# EAGLE design ver3.0+VinSeparat (EAGLE 6.1)
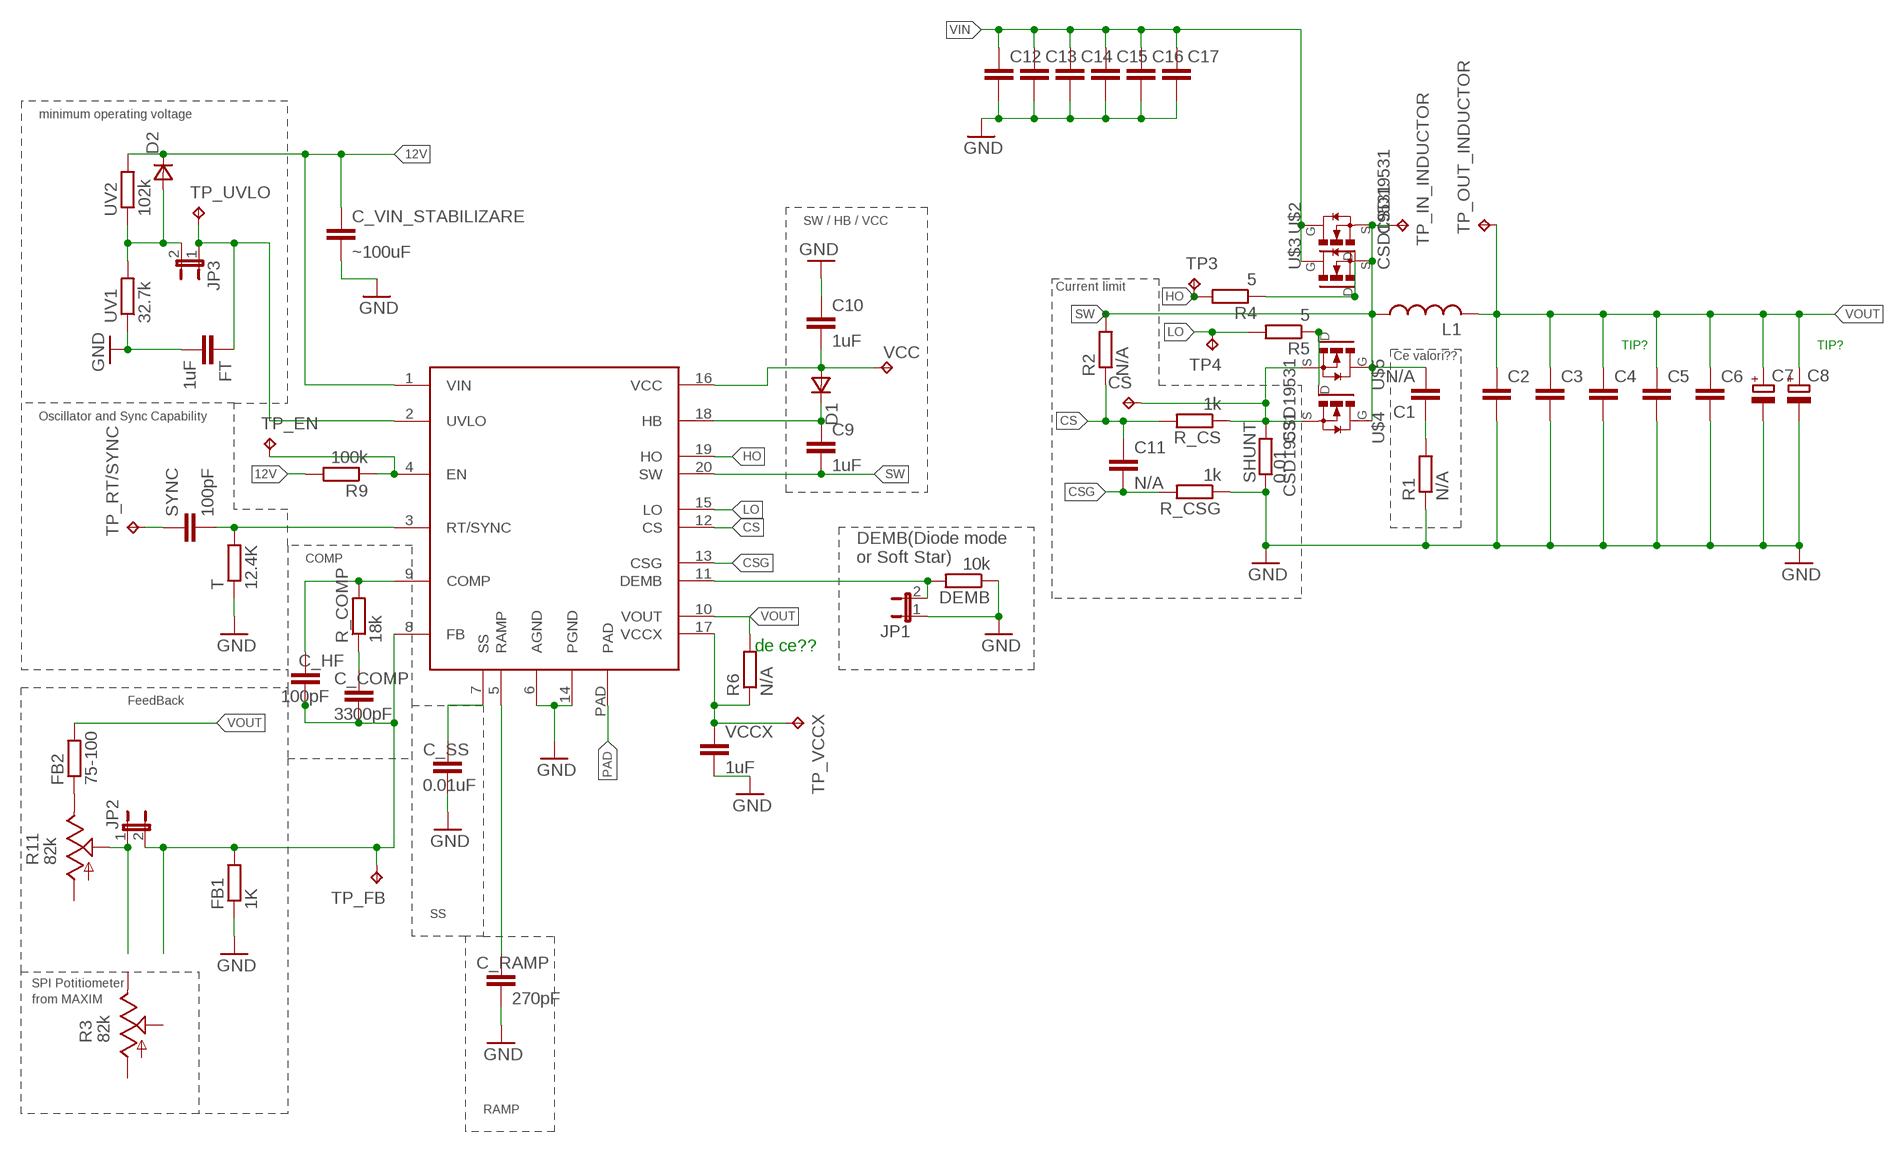
[diagram p0: schematic, sheet 1]

## Parts
C1  N/A  C-EUC0805K  [C0805K]
C2  C-EUC1812  [C1812]
C3  C-EUC1812  [C1812]
C4  C-EUC1812  [C1812]
C5  C-EUC1812  [C1812]
C6  C-EUC1812  [C1812]
C7  CPOL-EU153CLV-1012  [153CLV-1012]
C8  CPOL-EU153CLV-1012  [153CLV-1012]
C9  1uF  C-EUC0805K  [C0805K]
C10  1uF  C-EUC0805K  [C0805K]
C11  N/A  C-EUC0805K  [C0805K]
C12  C-EUC1812K  [C1812K]
C13  C-EUC1812K  [C1812K]
C14  C-EUC1812K  [C1812K]
C15  C-EUC1812K  [C1812K]
C16  C-EUC1812K  [C1812K]
C17  C-EUC1812K  [C1812K]
C_COMP  3300pF  C-EUC0805K  [C0805K]
C_HF  100pF  C-EUC0805K  [C0805K]
C_RAMP  270pF  C-EUC0805K  [C0805K]
C_SS  0.01uF  C-EUC0805K  [C0805K]
C_VIN_STABILIZARE  ~100uF  C-EUC0805K  [C0805K]
CS  TPPAD1-20  [P1-20]
D1  DSOT23  [SOT-23]
D2  DSOT23  [SOT-23]
DEMB  10k  R-EU_R0603  [R0603]
FB1  1K  R-EU_R0603  [R0603]
FB2  75-100  R-EU_R0603  [R0603]
FT  1uF  C-EUC1812K  [C1812K]
JP1  JP1E  [JP1]
JP2  JP1E  [JP1]
JP3  JP1E  [JP1]
L1  L-USTJ8-U2  [TJ8-U2]
R1  N/A  R-EU_M1206  [M1206]
R2  N/A  R-EU_R0603  [R0603]
R3  82k  TRIM_US-B64Y  [B64Y]
R4  5  R-EU_M1206  [M1206]
R5  5  R-EU_M1206  [M1206]
R6  N/A  R-EU_R0603  [R0603]
R9  100k  R-EU_R0603  [R0603]
R11  82k  TRIM_US-B64Y  [B64Y]
R_COMP  18k  R-EU_R0603  [R0603]
R_CS  1k  R-EU_R0603  [R0603]
R_CSG  1k  R-EU_R0603  [R0603]
SHUNT  0.01  SMR-0  [SMR-0]
SYNC  100pF  C-EUC0805K  [C0805K]
T  12.4K  R-EU_R0603  [R0603]
TP3  TPPAD1-20  [P1-20]
TP4  TPPAD1-20  [P1-20]
TP_EN  TPPAD1-20  [P1-20]
TP_FB  TPPAD1-20  [P1-20]
TP_IN_INDUCTOR  TPPAD1-20  [P1-20]
TP_OUT_INDUCTOR  TPPAD1-20  [P1-20]
TP_RT/SYNC  TPPAD1-20  [P1-20]
TP_UVLO  TPPAD1-20  [P1-20]
TP_VCCX  TPPAD1-20  [P1-20]
U$1  LM5116  [TSSOP20]
U$2  CSD19531  [TO220H]
U$3  CSD19531  [TO220H]
U$4  CSD19531  [TO220H]
U$5  CSD19531  [TO220H]
UV1  32.7k  R-EU_R0603  [R0603]
UV2  102k  R-EU_R0603  [R0603]
VCC  TPPAD1-20  [P1-20]
VCCX  1uF  C-EUC0805K  [C0805K]

## Nets
12V: C_VIN_STABILIZARE.1 D2.1(C) R9.2 U$1.1(VIN) UV2.2
CS: C11.1 R2.1 R_CS.2 U$1.12(CS)
CSG: C11.2 R_CSG.2 U$1.13(CSG)
DEMB: DEMB.2 JP1.2 U$1.11(DEMB)
GND: C2.2 C3.2 C4.2 C5.2 C6.2 C7.- C8.- C10.1 C12.2 C13.2 C14.2 C15.2 C16.2 C17.2 C_RAMP.2 C_SS.2 C_VIN_STABILIZARE.2 DEMB.1 FB1.1 FT.2 JP1.1 R1.1 R_CSG.1 SHUNT.2 T.1 U$1.6(AGND) U$1.14(PGND) UV1.1 VCCX.2
HB: C9.1 D1.1(C) U$1.18(HB)
HO: R4.2 TP3.TP U$1.19(HO)
LO: R5.2 TP4.TP U$1.15(LO)
N$1: R6.1 TP_VCCX.TP U$1.17(VCCX) VCCX.1
N$2: C1.1 R1.2
N$3: CS.TP R_CS.1 SHUNT.1 U$4.3(S) U$5.3(S)
N$4: R9.1 TP_EN.TP U$1.4(EN)
N$5: SYNC.2 T.2 U$1.3(RT/SYNC)
N$6: R4.1 U$2.1(G) U$3.1(G)
N$7: SYNC.1 TP_RT/SYNC.TP
N$8: FB2.1 R11.E
N$9: C_HF.1 R_COMP.2 U$1.9(COMP)
N$10: C_COMP.1 R_COMP.1
N$11: C_SS.1 U$1.7(SS)
N$12: C_RAMP.1 U$1.5(RAMP)
N$13: JP2.1 R11.S
N$14: FT.1 JP3.1 TP_UVLO.TP U$1.2(UVLO)
N$15: C_COMP.2 C_HF.2 FB1.2 JP2.2 TP_FB.TP U$1.8(FB)
N$16: R5.1 U$4.1(G) U$5.1(G)
PAD: U$1.PAD
SW: C1.2 C9.2 L1.1 R2.2 TP_IN_INDUCTOR.TP U$1.20(SW) U$2.3(S) U$3.3(S) U$4.2(D) U$4.T(D) U$5.2(D) U$5.T(D)
UVLO: D2.3(A) JP3.2 UV1.2 UV2.1
VCC: C10.2 D1.3(A) U$1.16(VCC) VCC.TP
VIN: C12.1 C13.1 C14.1 C15.1 C16.1 C17.1 U$2.2(D) U$2.T(D) U$3.2(D) U$3.T(D)
VOUT: C2.1 C3.1 C4.1 C5.1 C6.1 C7.+ C8.+ FB2.2 L1.2 R6.2 TP_OUT_INDUCTOR.TP U$1.10(VOUT)
Unconnected: R3.A R3.E R3.S R11.A

## Notes on the sheet
- minimum operating voltage
- SW / HB / VCC
- Current limit
- TIP? | TIP?
- Ce valori??
- Oscillator and Sync Capability
- COMP
- DEMB(Diode mode 
  or Soft Star)
- de ce??
- FeedBack
- SS
- SPI Potitiometer
- from MAXIM
- RAMP

## Library data of the parts
C1 C9-C11 C_COMP C_HF C_RAMP C_SS C_VIN_STABILIZARE SYNC VCCX = resistor:C-EU: CAPACITOR, European symbol
C2-C6 C12-C17 FT = rcl:C-EU: CAPACITOR, European symbol
C7 C8 = resistor:CPOL-EU: POLARIZED CAPACITOR, European symbol
CS TP3 TP4 TP_EN TP_FB TP_IN_INDUCTOR TP_OUT_INDUCTOR TP_RT/SYNC TP_UVLO TP_VCCX VCC = testpad:TP: Test pad
D1 D2 = zetex:D: DIODE; MPN: CDSOT23-T03; OC_FARNELL: 1824866; OC_NEWARK: 75K7096
DEMB FB1 FB2 R2 R6 R9 R_COMP R_CS R_CSG T UV1 UV2 = rcl:R-EU_: RESISTOR, European symbol
JP1-JP3 = jumper:JP1E: JUMPER
L1 = rcl:L-US: INDUCTOR, American symbol
R1 R4 R5 = resistor:R-EU_: RESISTOR, European symbol
R3 R11 = pot:TRIM_US-: POTENTIOMETER
SHUNT = resistor-shunt:SMR-0: SMD SHUNT RESISTOR; OC_FARNELL: unknown; OC_NEWARK: unknown
U$1 = 48buck_library:LM5116
U$2-U$5 = library:CSD19531

## Board
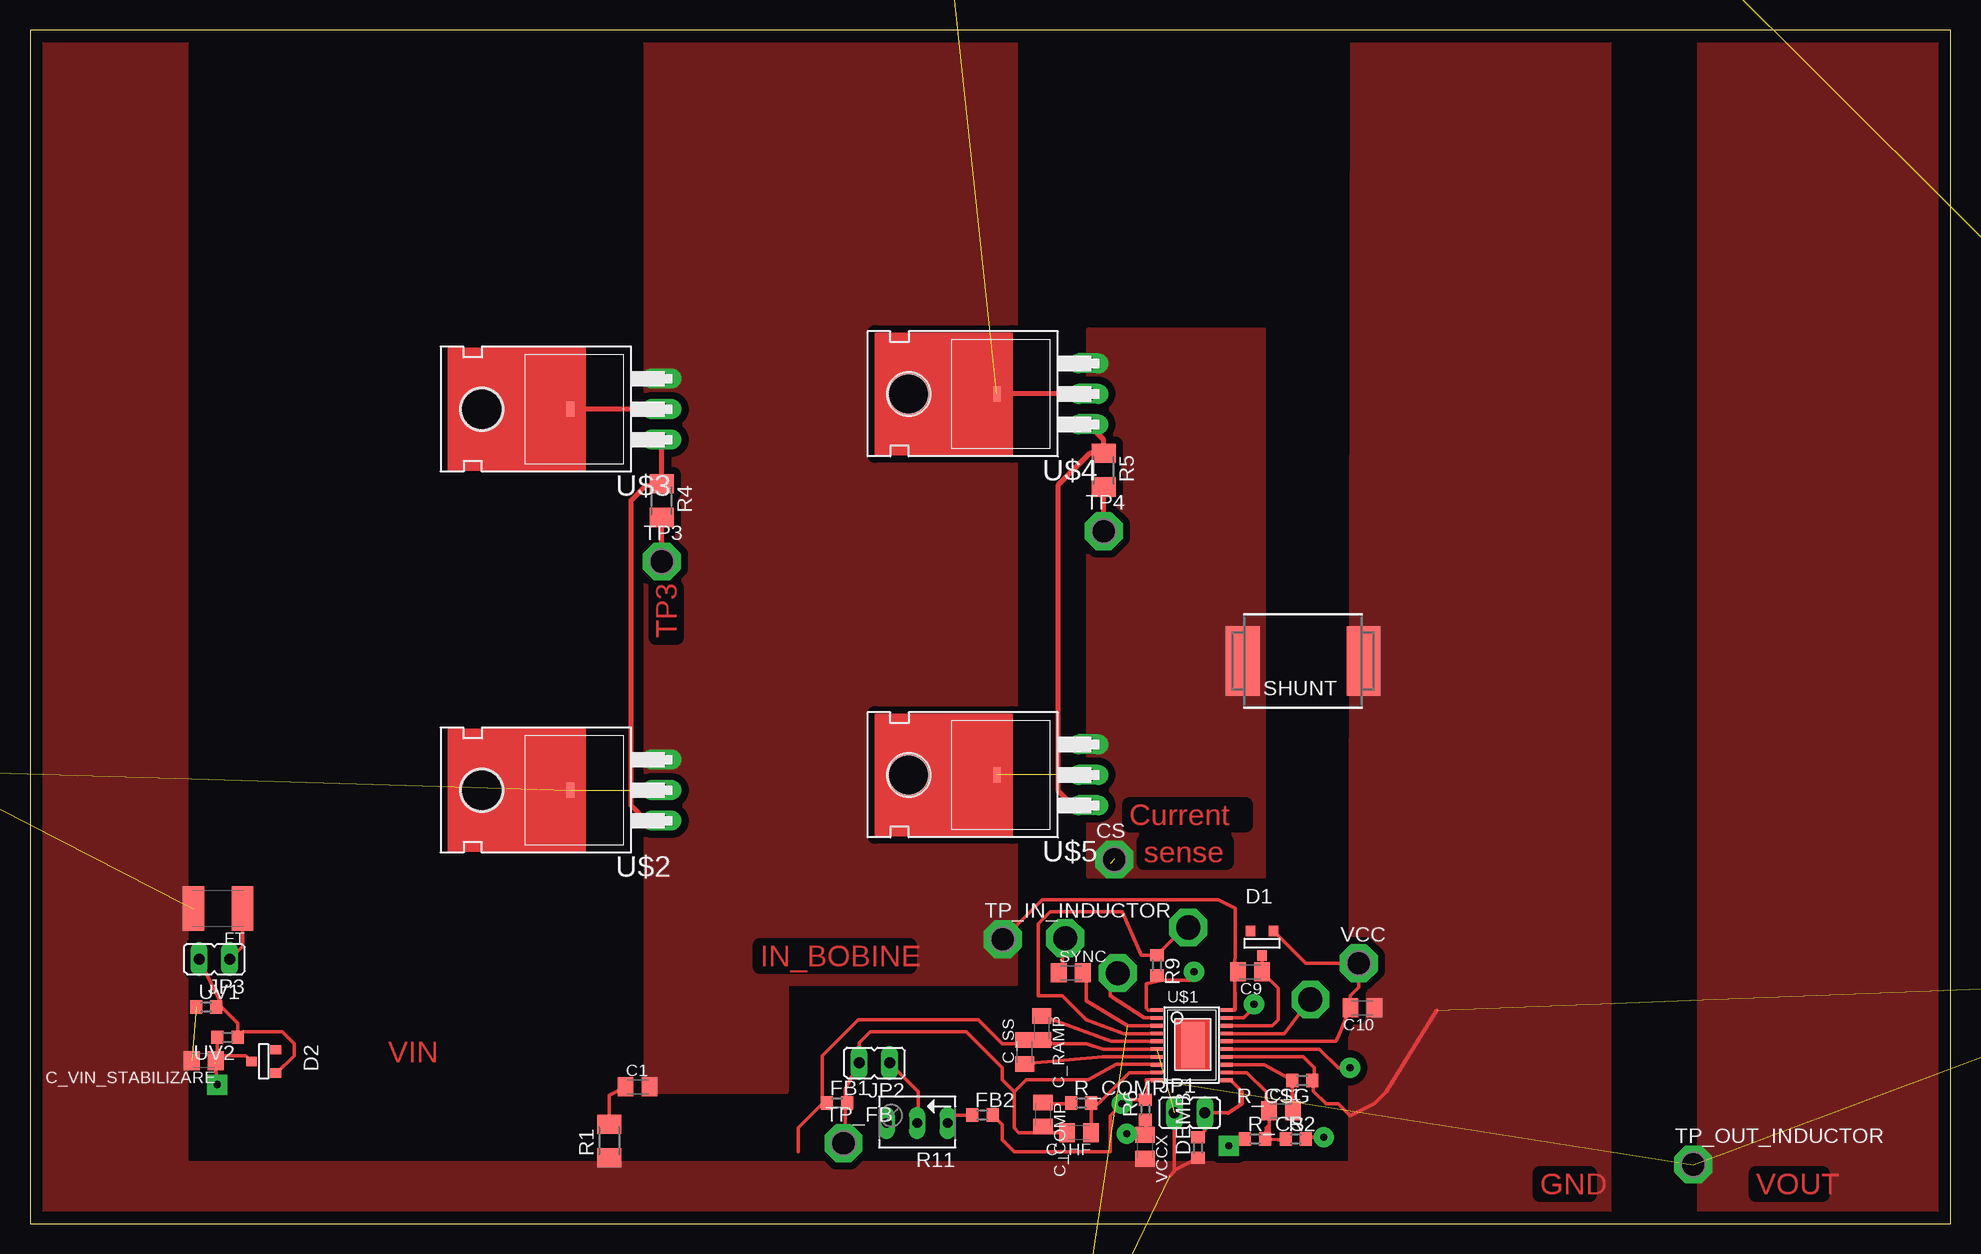
[diagram p1: board, top side]
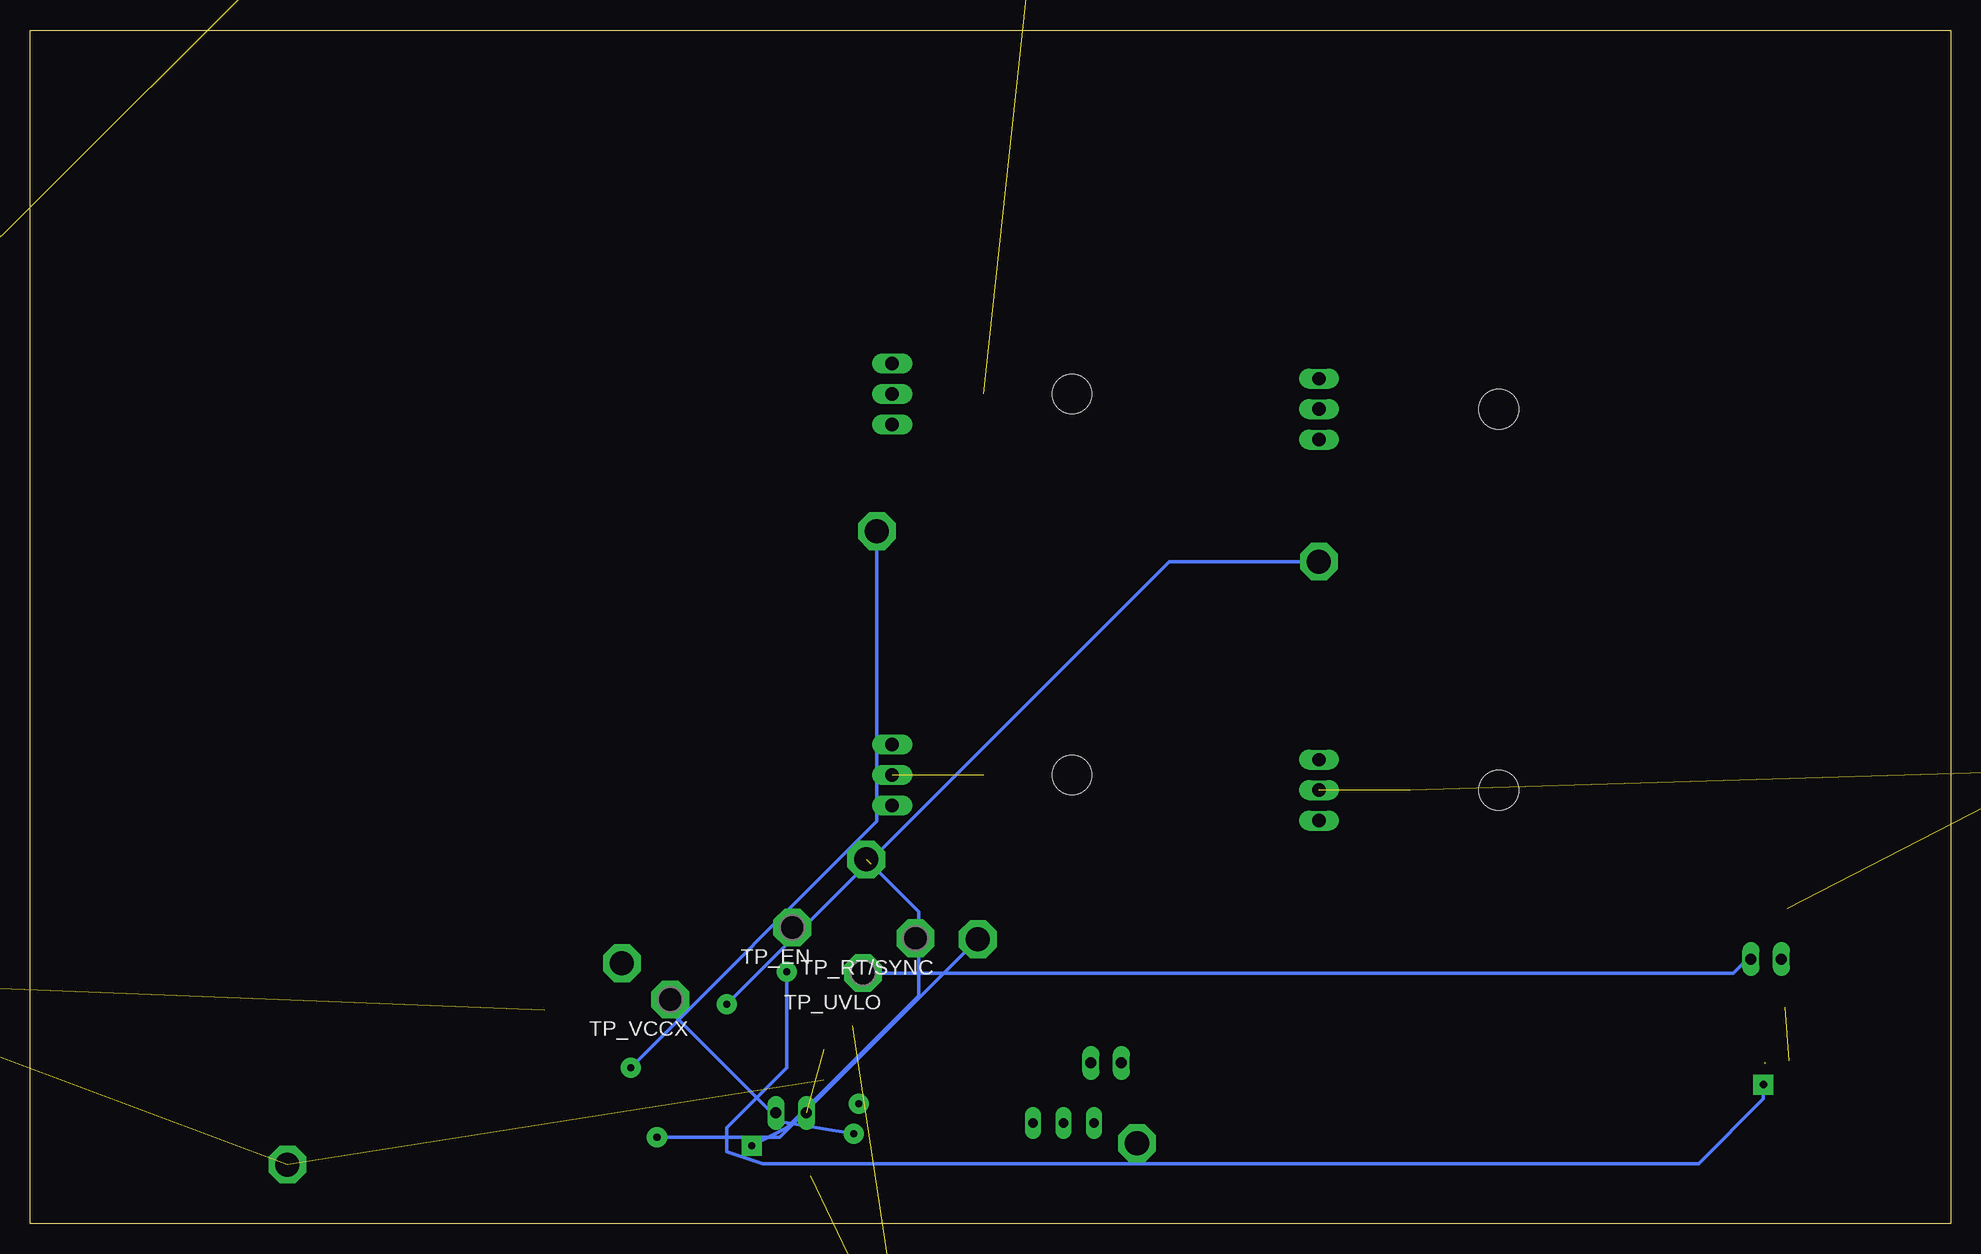
[diagram p2: board, bottom side, seen from below]

Size 160.05 x 99.48 mm. Coordinates in mm from the lower left corner, seen from the top.
Outline: 0,0 160.05,0 160.05,99.46 0,99.48 0,0
Copper layers (1*16): Top 0.035mm / dielectric 1.5mm / Bottom 0.035mm
Design rules: minimum track width 10mil, minimum drill 24mil, track to track 8mil, track to pad 8mil, pad to pad 8mil, via to via 8mil, smd to smd 8mil, copper to edge 40mil, drill to drill 8mil, minimum pad ring 10mil, minimum via ring 8mil, stop-mask expansion 4mil, vias tented up to drill 0mil, thermal gap 10mil

### Footprints (pad centres in the part's own frame; a part is rotated, then mirrored left to right if it is on the bottom)
C0805K = smd 1.3 x 1.6: 1 -1,0; 2 1,0
C1812 = smd 1.9 x 3.4: 1 -1.95,0; 2 1.95,0
153CLV-1012 = smd 4.3 x 2.5: + 4.15,0; - -4.15,0
C1812K = smd 1.8 x 3.7: 1 -2.05,0; 2 2.05,0
P1-20 = drill 2.007 pad 3.15 octagon: TP 0,0
SOT-23 = smd 0.787 x 0.889: 1 0.025,-1.016; 2 -0.94,1.016; 3 0.991,1.016
R0603 = smd 1 x 1.1: 1 -0.85,0; 2 0.85,0
JP1 = drill 0.914 long: 1 0,-1.27; 2 0,1.27
TJ8-U2 = drill 1.5: 1 -22.35,0; 2 22.35,0
M1206 = smd 1.6 x 2: 1 -1.4,0; 2 1.4,0
B64Y = drill 0.813 long: A 2.54,0; E -2.54,0; S 0,0
SMR-0 = smd 2.8 x 5.8: 1 5.029,0; 2 -5.029,0
TSSOP20 = smd 0.305 x 0.991: 1 -3.025,-3.118; 2 -2.375,-3.118; 3 -1.725,-3.118; 4 -1.075,-3.118; 5 -0.425,-3.118; 6 0.225,-3.118; 7 0.875,-3.118; 8 1.525,-3.118; 9 2.175,-3.118; 10 2.825,-3.118; 11 2.825,2.718; 12 2.175,2.718; 13 1.525,2.718; 14 0.875,2.718; 15 0.225,2.718; 16 -0.425,2.718; 17 -1.075,2.718; 18 -1.725,2.718; 19 -2.375,2.718; 20 -3.025,2.718 | smd 3.81 x 1.93: PAD -0.1,-0.1
TO220H = drill 1.118 long: 1 -2.54,-10.16; 2 0,-10.16; 3 2.54,-10.16 | smd 1.27 x 0.635: T 0,-2.54 | hole 3.302: 0,4.826

### Placement (x,y rotation side)
C1  50.64,11.41 0 top
C2  177.25,20.08 180 top  (outside the outline)
C3  177.25,24.59 180 top  (outside the outline)
C4  177.25,30.37 180 top  (outside the outline)
C5  177.25,37.15 180 top  (outside the outline)
C6  177.25,43.66 180 top  (outside the outline)
C7  176.82,51.88 0 top  (outside the outline)
C8  176.85,63.88 0 top  (outside the outline)
C9  101.65,20.99 180 top
C10  111.03,17.99 180 top
C11  104.26,9.41 0 top
C12  -6.44,37.64 180 top  (outside the outline)
C13  -6.09,42.64 180 top  (outside the outline)
C14  -6.74,48.64 180 top  (outside the outline)
C15  -6.39,53.64 180 top  (outside the outline)
C16  -6.04,58.64 180 top  (outside the outline)
C17  -6.69,68.64 180 top  (outside the outline)
C_COMP  84.41,9.1 270 top
C_HF  87.42,7.59 180 top
C_RAMP  84.31,16.32 270 top
C_SS  82.89,14.33 90 top
C_VIN_STABILIZARE  14.48,13.59 180 top
CS  90.36,30.36 0 top
D1  102.65,23.37 0 top
D2  19.47,13.56 270 top
DEMB  97.34,6.34 90 top
FB1  67.26,10.06 0 top
FB2  79.36,9.06 0 top
FT  15.67,26.26 180 top
JP1  96.63,9.24 270 top
JP2  70.37,13.41 90 top
JP3  15.37,22.06 90 top
L1  96.9,125.4 0 top  (outside the outline)
R1  48.26,6.9 90 top
R2  105.48,7.06 0 top
R3  70.61,-7.69 270 top  (outside the outline)
R4  52.64,60.26 270 top
R5  89.47,62.8 270 top
R6  92.94,9.5 90 top
R9  93.91,21.54 270 top
R11  73.93,8.39 180 top
R_COMP  87.6,10.06 0 top
R_CS  102.09,7.06 0 top
R_CSG  106.02,11.94 180 top
SHUNT  106.09,46.91 180 top
SYNC  86.73,20.91 0 top
T  88.76,-7.26 180 top  (outside the outline)
TP3  52.64,55.18 0 top
TP4  89.47,57.72 0 top
TP_EN  96.52,24.69 180 bottom
TP_FB  67.8,6.71 0 top
TP_IN_INDUCTOR  81.06,23.71 0 top
TP_OUT_INDUCTOR  138.6,4.93 0 top
TP_RT/SYNC  86.26,23.79 180 bottom
TP_UVLO  90.64,20.89 180 bottom
TP_VCCX  106.7,18.69 180 bottom
U$1  97.01,14.78 270 top
U$2  42.48,36.13 90 top
U$3  42.48,67.88 90 top
U$4  78.04,69.15 90 top
U$5  78.04,37.4 90 top
UV1  14.69,18.06 0 top
UV2  16.46,15.54 180 top
VCC  110.72,21.71 0 top
VCCX  92.91,6.42 270 top

### Tracks (layer width: path | path; a pad name or v marks a point on that pad's centre or on a via)
12V  (via drill 0.6 pad 1.68)  (1 unrouted)
  Top 0.305: UV2.2 15.61,13.5 C_VIN_STABILIZARE.1 15.45,13.34 v15.6,11.6 | 15.45,13.45 16,14 17.99,14 D2.1 | U$1.1 93.19,17.8 93,18 93,20 94.31,20.31 | R9.2 94.31,20.31 | 94.31,20.31 96.69,20.31 v97,21
  Bottom 0.305: v97,21 97,13 102,8 102,6 99,5 21,5 15.6,10.4 v15.6,11.6
CS
  Top 0.305: U$1.12 101.39,12.61 103,11 103,10 103.26,9.74 C11.1 103.26,8.26 | 103.26,8.26 103,8 R_CS.2 | 103.26,8.26 103.26,7.04 104,7 104.81,7 R2.1
CSG
  Top 0.305: C11.2 105.17,11.02 R_CSG.2 102.86,13.26 U$1.13
DEMB
  Top 0.305: 100,12 99.95,11.96 U$1.11 100.05,11.96 100,11.96 100,12 | 100,12 101,11 101,10 99.8,9.2 99.76,9.24 JP1.2 97.9,7.75 DEMB.2
GND  (16 unrouted)
  Top 0.305: 117.21,17.79 113,11 112,10 110,9 109,10 108,10 106.94,11.06 106.94,11.94 R_CSG.1 107,12.07 107,13 106.09,13.9 U$1.14 | 86,15 88,15 89.44,14.55 U$1.6 | 84,15 83.96,15.84 83.97,15.64 C_RAMP.2 84.09,15.26 | 84,15 83,15.44 C_SS.2 | C_SS.2 82.89,15.11 86,15 | 95.36,4.47 DEMB.1 | JP1.1 95.36,4.47 | 95.36,4.47 95.36,4.36 95,4 | 85,15 85.56,15 C_SS.2 | FB1.1 66.06,10.06 66,10 | 66,10 64,8 64,6 | 86,15 84,15 | 84,15 81,15 79,17 69,17 66,14 66,10
  pour Top (isolate 0.61, no thermals): 110.17,99.47 110,5 13,5 13,99 1,99 1,1 131.62,1 131.62,99.47
HB
  Top 0.305: U$1.18 103.5,16.5 104,17 104,19.64 C9.1 102.67,21.02 D1.1
HO  (via drill 0.6 pad 1.68)
  Top 0.305: U$1.19 101.16,17.16 102,18 v102,18.3
  Top 0.406: TP3.TP R4.2
  Bottom 0.305: TP3.TP 65.12,55.18 v102,18.3
LO  (via drill 0.6 pad 1.68)
  Top 0.305: 102.56,14.55 U$1.15 107.44,14.55 109,13 v110,13
  Top 0.406: TP4.TP R5.2
  Bottom 0.305: TP4.TP 89.47,33.53 v110,13
N$1  (via drill 0.6 pad 1.68)
  Top 0.305: U$1.17 104.53,15.86 TP_VCCX.TP | R6.1 93,8.51 93,8 93.11,7.89 VCCX.1 92.68,7.65 91.35,7.65 v91.4,7.5
  Bottom 0.305: v91.4,7.5 97.5,8.5 107.69,18.69 | TP_VCCX.TP 107.69,18.69 | 107.69,18.69 108,19
N$2
  Top 0.305: R1.2 48.26,10.69 C1.1
N$3  (via drill 0.6 pad 1.68)  (1 unrouted)
  Top 0.305: v99.9,6.5 99.18,7 R_CS.1
  Bottom 0.305: v99.9,6.5 97,8 86,19 86,26 90,30
  pour Top (isolate 0.61, no thermals): 88.2,74.47 88.2,29 102.82,29 102.82,74.47
N$4
  Top 0.305: TP_EN.TP 96.21,24.69 R9.1 92.61,22.39 91,26 85,26 84,25 84,19 86,19 88,17 91.14,15.86 U$1.4
N$5  (1 unrouted)
  Top 0.305: U$1.3 91.5,16.5 88,18.6 88,21 87.82,21 SYNC.2
N$6
  Top 0.406: U$2.1 51.37,33.59 50.1,34.86 50.1,60.26 51.37,61.53 52.51,61.53 R4.1 U$3.1
N$7
  Top 0.305: SYNC.1 85.91,20.91 86,21 86,23.53 TP_RT/SYNC.TP
N$8
  Top 0.305: FB2.1 77.14,9.06 R11.E
N$9
  Top 0.305: U$1.9 91.61,12.61 89,10 88.51,10 R_COMP.2 88.42,10.03 C_HF.1
N$10
  Top 0.305: R_COMP.1 86.94,10.06 87,10 85.31,10 C_COMP.1
N$11
  Top 0.305: U$1.7 89.39,13.9 C_SS.1
N$12
  Top 0.305: U$1.5 90.11,15.21 C_RAMP.1
N$13
  Top 0.305: JP2.1 72.64,12.36 74,11 74,8.46 R11.S
N$14
  Top 0.305: FT.1 17.72,23.14 JP3.1 | U$1.2 92.84,17.16 90,19 90,20.25 TP_UVLO.TP
  Bottom 0.305: TP_UVLO.TP 18.11,20.89 16.94,22.06 JP3.1
N$15
  Top 0.305: C_COMP.2 84.92,7.59 C_HF.2 82.41,7.59 82,8 82,11 | FB1.2 67.94,11.25 | 67.94,11.25 JP2.2 69.1,15.1 70,16 78,16 81,13 81,12 82,11 | 67.94,11.25 67.94,6.85 TP_FB.TP | U$1.8 93.85,13.3 90.5,13.3 88.2,12 83,12 82,11
N$16
  Top 0.406: U$4.1 89.47,65.34 R5.1 88.33,64.2 85.66,61.53 85.66,36.13 86.93,34.86 U$5.1
SW  (via drill 0.6 pad 1.68)  (2 unrouted)
  Top 0.305: C9.2 100.4,20.99 100.4,20.8 100.43,17.87 U$1.20 100.4,17.8 100.4,17.9 100.43,26.27 99,27 84.35,27 TP_IN_INDUCTOR.TP | v107.8,7.2 106.47,7.2 R2.2
  Top 0.406: U$4.2 U$4.T
  Bottom 0.305: v107.8,7.2 97.57,7.2 TP_IN_INDUCTOR.TP
  pour Top (isolate 0.61, no thermals): 82.12,20 63,20 63,11 51.37,11 51.37,99.47 82.12,99.47
UVLO
  Top 0.305: D2.3 20.57,12.57 22,14 22,15 21,16 17.77,16 UV2.1 17.31,16.69 16,18 15.6,18 UV1.2 15.9,18.42 JP3.2
VCC
  Top 0.305: U$1.16 108.8,15.21 109.01,15.59 C10.2 110,18.02 110,19 110.72,19.72 VCC.TP 106.32,21.71 D1.3
VIN  (7 unrouted)
  Top 0.406: U$3.2 U$3.T
  pour Top (isolate 1.27, no thermals): 46.56,11 46.56,99.47 18.08,99.47 18.08,11
VOUT  (via drill 0.6 pad 1.68)  (9 unrouted)
  Top 0.305: U$1.10 93.85,12 93,12 93.14,11.14 R6.2 91.35,10.35 v91,10 90,9 90,6 82,6 81,7 81,8.27 FB2.2
  pour Top (isolate 0.61, no thermals): 160.11,99.47 160.11,1 139.16,1 139.16,99.47

### Text on the board
Top: TP3 | Current | sense | IN_BOBINE | VIN | GND | VOUT | rezistenta NOT SMD